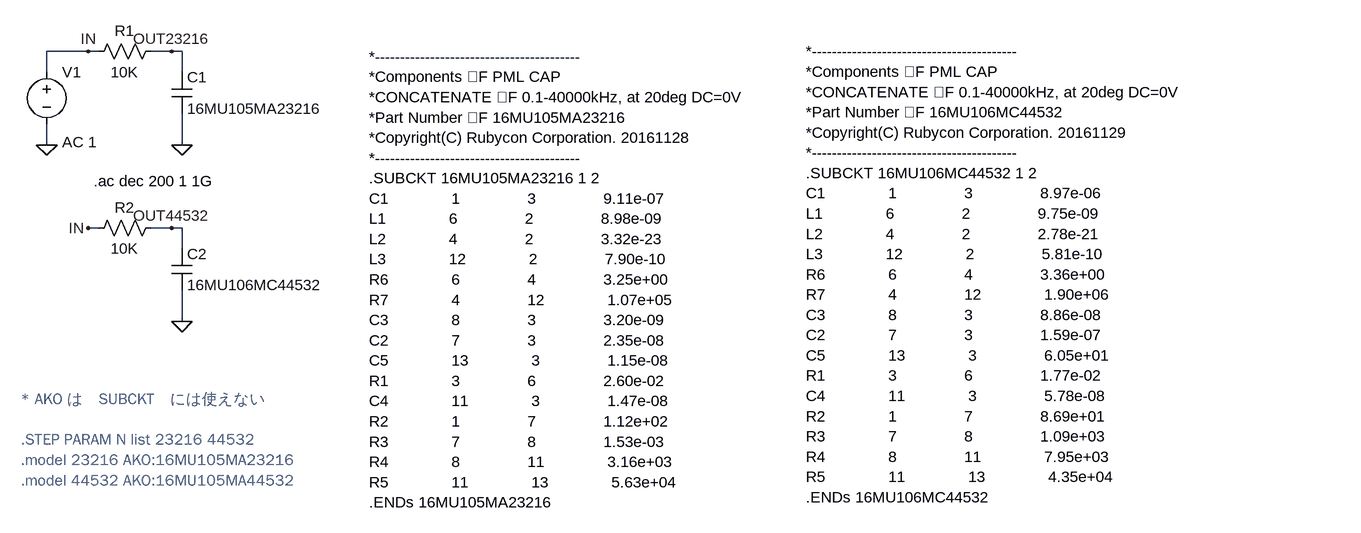
[diagram p0: schematic AKO_16MU105MA2326_AC.asc]
AKO_16MU105MA2326_AC.asc, the LTspice schematic file:
Version 4
SHEET 1 1996 848
WIRE -32 112 -96 112
WIRE -16 112 -32 112
WIRE 96 112 64 112
WIRE 112 112 96 112
WIRE -96 144 -96 112
WIRE 112 144 112 112
WIRE -96 256 -96 224
WIRE 112 256 112 208
WIRE -16 384 -32 384
WIRE 96 384 64 384
WIRE 112 384 96 384
WIRE 112 416 112 384
WIRE 112 528 112 480
FLAG 112 256 0
FLAG -96 256 0
FLAG -32 112 IN
FLAG 96 112 OUT23216
FLAG 112 528 0
FLAG -32 384 IN
FLAG 96 384 OUT44532
SYMBOL cap 96 144 R0
SYMATTR InstName C1
SYMATTR Value 16MU105MA23216
SYMATTR Prefix X
SYMBOL voltage -96 128 R0
WINDOW 123 24 124 Left 2
WINDOW 39 0 0 Left 2
SYMATTR Value2 AC 1
SYMATTR InstName V1
SYMATTR Value ""
SYMBOL res -32 128 R270
WINDOW 0 32 56 VTop 2
WINDOW 3 0 56 VBottom 2
SYMATTR InstName R1
SYMATTR Value 10K
SYMBOL cap 96 416 R0
SYMATTR InstName C2
SYMATTR Value 16MU106MC44532
SYMATTR Prefix X
SYMBOL res -32 400 R270
WINDOW 0 32 56 VTop 2
WINDOW 3 0 56 VBottom 2
SYMATTR InstName R2
SYMATTR Value 10K
TEXT 400 120 Left 2 !*-----------------------------------------                                      \n*Components F PML CAP                                          \n*CONCATENATE F 0.1-40000kHz, at 20deg DC=0V                                    \n*Part Number F 16MU105MA23216                                  \n*Copyright(C) Rubycon Corporation. 20161128                                     \n*-----------------------------------------                                      \n.SUBCKT 16MU105MA23216 1 2                                      \nC1              1               3               9.11e-07\nL1              6               2               8.98e-09\nL2              4               2               3.32e-23\nL3              12              2               7.90e-10\nR6              6               4               3.25e+00\nR7              4               12              1.07e+05\nC3              8               3               3.20e-09\nC2              7               3               2.35e-08\nC5              13              3               1.15e-08\nR1              3               6               2.60e-02\nC4              11              3               1.47e-08\nR2              1               7               1.12e+02\nR3              7               8               1.53e-03\nR4              8               11              3.16e+03\nR5              11              13              5.63e+04\n.ENDs 16MU105MA23216
TEXT -24 312 Left 2 !.ac dec 200 1 1G
TEXT 1072 112 Left 2 !*-----------------------------------------                                      \n*Components F PML CAP                                          \n*CONCATENATE F 0.1-40000kHz, at 20deg DC=0V                                    \n*Part Number F 16MU106MC44532                                  \n*Copyright(C) Rubycon Corporation. 20161129                                     \n*-----------------------------------------                                      \n.SUBCKT 16MU106MC44532 1 2                                      \nC1              1               3               8.97e-06\nL1              6               2               9.75e-09\nL2              4               2               2.78e-21\nL3              12              2               5.81e-10\nR6              6               4               3.36e+00\nR7              4               12              1.90e+06\nC3              8               3               8.86e-08\nC2              7               3               1.59e-07\nC5              13              3               6.05e+01\nR1              3               6               1.77e-02\nC4              11              3               5.78e-08\nR2              1               7               8.69e+01\nR3              7               8               1.09e+03\nR4              8               11              7.95e+03\nR5              11              13              4.35e+04\n.ENDs 16MU106MC44532
TEXT -136 648 Left 2 ;* AKO は　SUBCKT　には使えない\n \n.STEP PARAM N list 23216 44532\n.model 23216 AKO:16MU105MA23216\n.model 44532 AKO:16MU105MA44532

The netlist it stands for:
* AKO_16MU105MA2326_AC.asc
XC1 OUT23216 0 16MU105MA23216  ; pins A B
V1 IN 0 AC 1
R1 IN OUT23216 10K
XC2 OUT44532 0 16MU106MC44532  ; pins A B
R2 IN OUT44532 10K
*-----------------------------------------
*Components F PML CAP
*CONCATENATE F 0.1-40000kHz, at 20deg DC=0V
*Part Number F 16MU105MA23216
*Copyright(C) Rubycon Corporation. 20161128
*-----------------------------------------
.SUBCKT 16MU105MA23216 1 2
C1              1               3               9.11e-07
L1              6               2               8.98e-09
L2              4               2               3.32e-23
L3              12              2               7.90e-10
R6              6               4               3.25e+00
R7              4               12              1.07e+05
C3              8               3               3.20e-09
C2              7               3               2.35e-08
C5              13              3               1.15e-08
R1              3               6               2.60e-02
C4              11              3               1.47e-08
R2              1               7               1.12e+02
R3              7               8               1.53e-03
R4              8               11              3.16e+03
R5              11              13              5.63e+04
.ENDs 16MU105MA23216
.ac dec 200 1 1G
*-----------------------------------------
*Components F PML CAP
*CONCATENATE F 0.1-40000kHz, at 20deg DC=0V
*Part Number F 16MU106MC44532
*Copyright(C) Rubycon Corporation. 20161129
*-----------------------------------------
.SUBCKT 16MU106MC44532 1 2
C1              1               3               8.97e-06
L1              6               2               9.75e-09
L2              4               2               2.78e-21
L3              12              2               5.81e-10
R6              6               4               3.36e+00
R7              4               12              1.90e+06
C3              8               3               8.86e-08
C2              7               3               1.59e-07
C5              13              3               6.05e+01
R1              3               6               1.77e-02
C4              11              3               5.78e-08
R2              1               7               8.69e+01
R3              7               8               1.09e+03
R4              8               11              7.95e+03
R5              11              13              4.35e+04
.ENDs 16MU106MC44532
* * AKO は　SUBCKT　には使えない
* .STEP PARAM N list 23216 44532
* .model 23216 AKO:16MU105MA23216
* .model 44532 AKO:16MU105MA44532
.backanno
.end